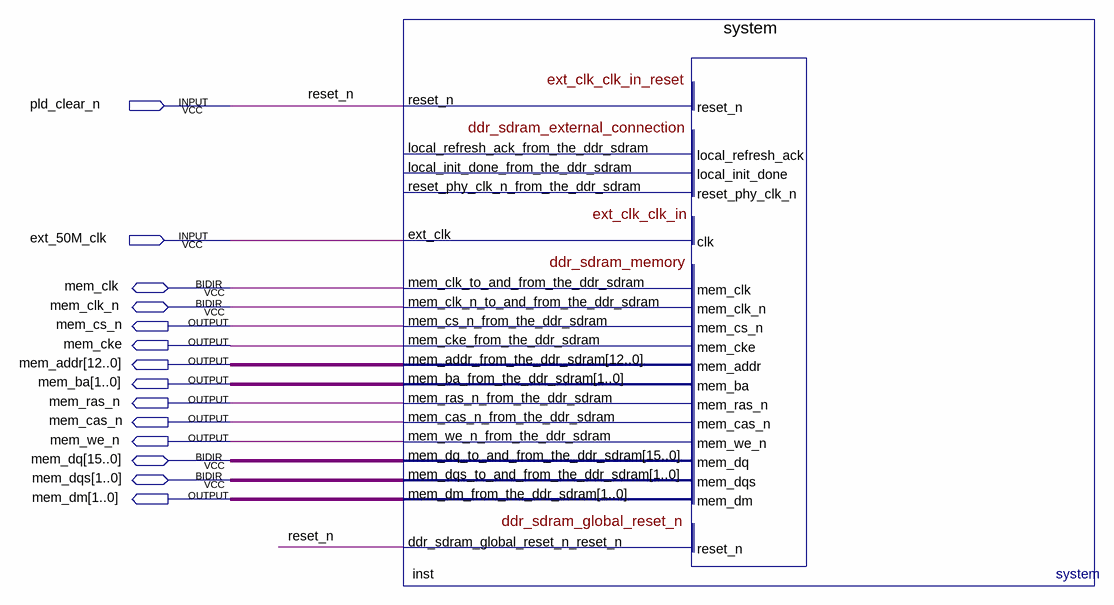
[diagram p0: schematic sheet]
// Quartus schematic NEEK.bdf as structural Verilog: 1 symbols, 14 pins
module NEEK (
  input  pld_clear_n,
  input  ext_50M_clk,
  inout  mem_clk,
  inout  mem_clk_n,
  inout  [15:0] mem_dq,
  inout  [1:0] mem_dqs,
  output mem_cs_n,
  output mem_cke,
  output [12:0] mem_addr,
  output [1:0] mem_ba,
  output mem_ras_n,
  output mem_cas_n,
  output mem_we_n,
  output [1:0] mem_dm
);

  system inst (
    .reset_n(pld_clear_n), .ext_clk(ext_50M_clk), .ddr_sdram_global_reset_n_reset_n(pld_clear_n),
    .mem_cs_n_from_the_ddr_sdram(mem_cs_n), .mem_cke_from_the_ddr_sdram(mem_cke),
    .mem_addr_from_the_ddr_sdram(mem_addr), .mem_ba_from_the_ddr_sdram(mem_ba),
    .mem_ras_n_from_the_ddr_sdram(mem_ras_n), .mem_cas_n_from_the_ddr_sdram(mem_cas_n),
    .mem_we_n_from_the_ddr_sdram(mem_we_n), .mem_dm_from_the_ddr_sdram(mem_dm),
    .mem_clk_to_and_from_the_ddr_sdram(mem_clk), .mem_clk_n_to_and_from_the_ddr_sdram(mem_clk_n),
    .mem_dq_to_and_from_the_ddr_sdram(mem_dq), .mem_dqs_to_and_from_the_ddr_sdram(mem_dqs));  // open: local_refresh_ack_from_the_ddr_sdram, local_init_done_from_the_ddr_sdram, reset_phy_clk_n_from_the_ddr_sdram

  // Other names for the same wires on the sheet: reset_n = pld_clear_n
endmodule
